# Altium schematic sheet M.2 & CSI2.SchDoc
size A4; SheetNumber: 4; SheetTotal: 4
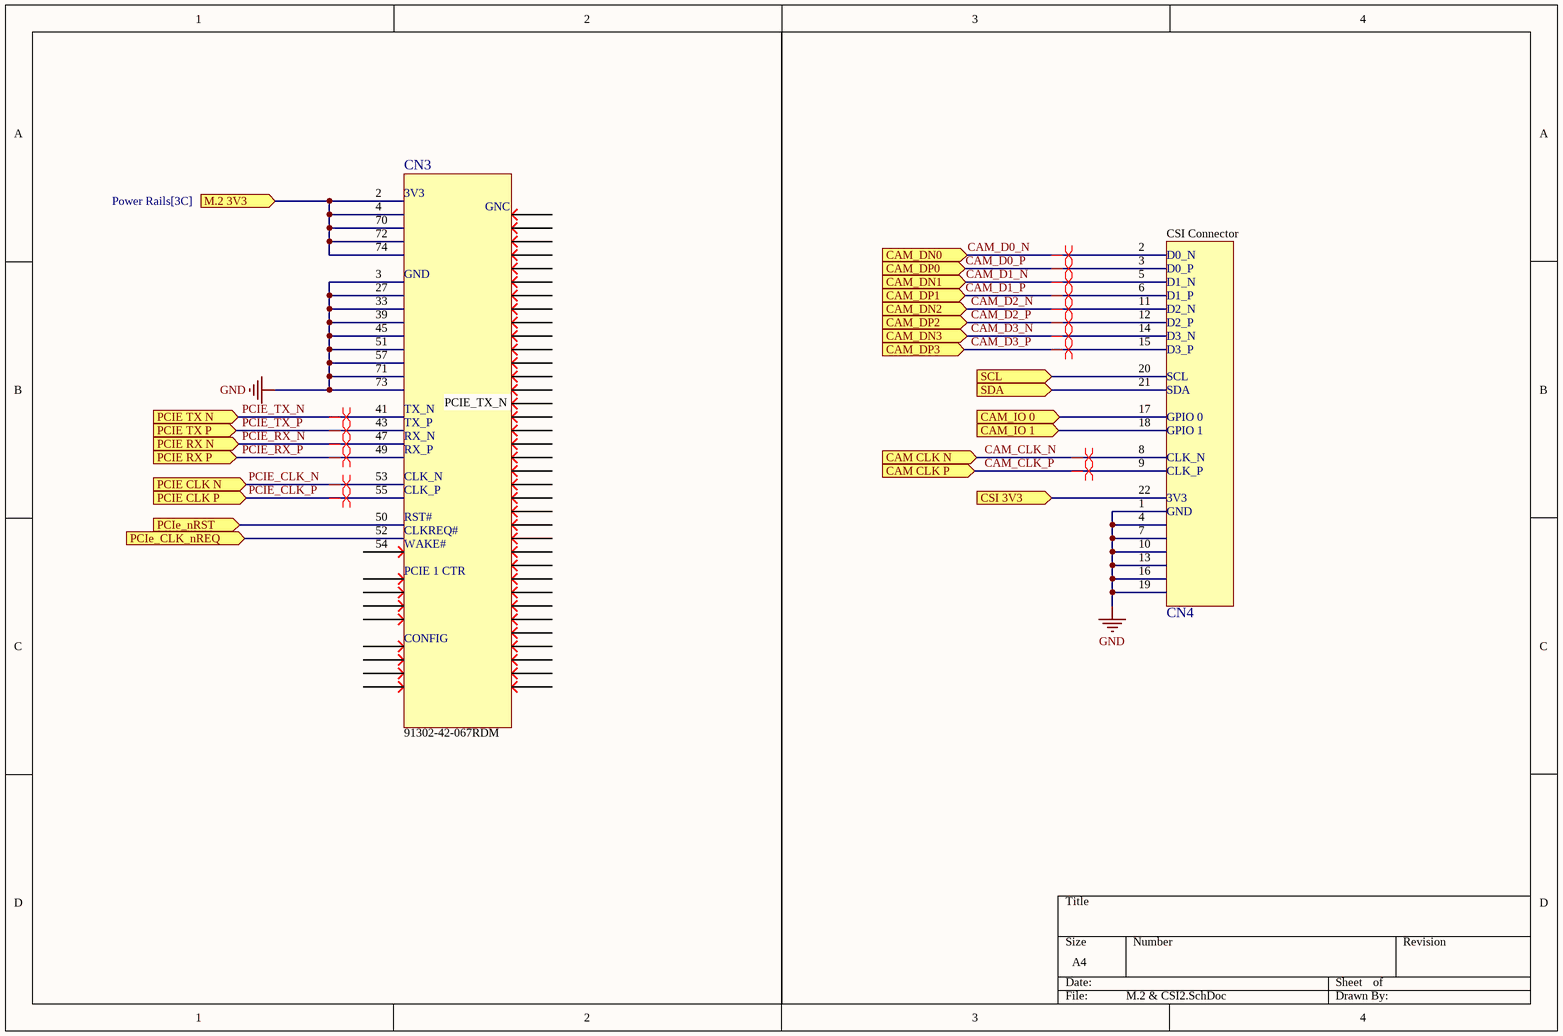
[diagram p0: M.2 & CSI2.SchDoc]

## Parts
CN3  91302-42-067RDM  [CONN-SMD_91302-32-067RDM]
CN4  CSI Connector  [FPC-SMD_22P-P0.50_FH55-22S-0.5SH]

## Ports
CAM CLK N (in, see Amphenol ICC[4A]), CAM CLK P (in, see Amphenol ICC[4A]), CAM_DN0 (in, see Amphenol ICC[4A]), CAM_DN1 (in, see Amphenol ICC[4A]), CAM_DN2 (in, see Amphenol ICC[4A]), CAM_DN3 (in, see Amphenol ICC[4A]), CAM_DP0 (in, see Amphenol ICC[4A]), CAM_DP1 (in, see Amphenol ICC[4A]), CAM_DP2 (in, see Amphenol ICC[4A]), CAM_DP3 (in, see Amphenol ICC[4A]), CAM_IO 0 (in, see Amphenol ICC[1B]), CAM_IO 1 (in, see Amphenol ICC[1B]), CSI 3V3 (in, see Power Rails[4C]), M.2 3V3 (in, see Power Rails[3C]), PCIE CLK N (in, see Amphenol ICC[3A]), PCIE CLK P (in, see Amphenol ICC[3A]), PCIE RX N (in, see Amphenol ICC[3B]), PCIE RX P (in, see Amphenol ICC[3A]), PCIE TX N (in, see Amphenol ICC[3B]), PCIE TX P (in, see Amphenol ICC[3B]), PCIe_CLK_nREQ (in, see Amphenol ICC[3A]), PCIe_nRST (in, see Amphenol ICC[3A]), SCL (in, see Amphenol ICC[1A]), SDA (in, see Amphenol ICC[1A])

## Nets
GND: CN3.3 CN3.27 CN3.33 CN3.39 CN3.45 CN3.51 CN3.57 CN3.71 CN3.73 CN4.1(GND) CN4.4(GND) CN4.7(GND) CN4.10(GND) CN4.13(GND) CN4.16(GND) CN4.19(GND)
CAM_CLK_N: CN4.8(CLK_N) ; port CAM CLK N
CAM_CLK_P: CN4.9(CLK_P) ; port CAM CLK P
CAM_D0_N: CN4.2(DATA_0_N) ; port CAM_DN0
CAM_D0_P: CN4.3(DATA_0_P) ; port CAM_DP0
CAM_D1_N: CN4.5(DATA_1_N) ; port CAM_DN1
CAM_D1_P: CN4.6(DATA_1_P) ; port CAM_DP1
CAM_D2_N: CN4.11(DATA_2_N) ; port CAM_DN2
CAM_D2_P: CN4.12(DATA_2_P) ; port CAM_DP2
CAM_D3_N: CN4.14(DATA_3_N) ; port CAM_DN3
CAM_D3_P: CN4.15(DATA_3_P) ; port CAM_DP3
CAM_IO 0: CN4.17(GPIO_0) ; port CAM_IO 0
CAM_IO 1: CN4.18(GPIO_1) ; port CAM_IO 1
CSI 3V3: CN4.22(PWR) ; port CSI 3V3
M.2 3V3: CN3.2 CN3.4 CN3.70 CN3.72 CN3.74 ; port M.2 3V3
PCIE_CLK_N: CN3.53 ; port PCIE CLK N
PCIe_CLK_nREQ: CN3.52 ; port PCIe_CLK_nREQ
PCIE_CLK_P: CN3.55 ; port PCIE CLK P
PCIe_nRST: CN3.50 ; port PCIe_nRST
PCIE_RX_N: CN3.47 ; port PCIE RX N
PCIE_RX_P: CN3.49 ; port PCIE RX P
PCIE_TX_N: CN3.41 ; port PCIE TX N
PCIE_TX_P: CN3.43 ; port PCIE TX P
SCL: CN4.20(SCL) ; port SCL
SDA: CN4.21(SDA) ; port SDA

Not connected (* = marked no-connect by the designer): CN3 1* 5* 6* 7* 8* 9* 10* 11* 12* 13* 14* 15* 16* 17* 18* 19* 20* 21* 22* 23* 24* 25* 26* 28* 29* 30* 31* 32* 34* 35* 36* 37* 38* 40* 42* 44* 46* 48* 54* 56* 58* 67* 68* 69* 75*

## Layout directives
differential pair: CAM_CLK_N, CAM_CLK_P, CAM_D0_N, CAM_D0_P, CAM_D1_N, CAM_D1_P, CAM_D2_N, CAM_D2_P, CAM_D3_N, CAM_D3_P, PCIE_CLK_N, PCIE_CLK_P, PCIE_RX_N, PCIE_RX_P, PCIE_TX_N, PCIE_TX_P

## Notes on the sheet
- (near CN3) PCIE_TX_N
- (in symbol 91302-42-067RDM) 3V3; GNC; GND; TX_N; TX_P; RX_N; RX_P; CLK_N; CLK_P; RST#; CLKREQ#; WAKE#; PCIE 1 CTR; CONFIG
- (in symbol FH55-22S-0.5SH) D0_N; D0_P; D1_N; D1_P; D2_N; D2_P; D3_N; D3_P; 3V3

## Library data of the parts
CN3 = 91302-42-067RDM: 67P Surface Mount, Right Angle SMD,P=0.5mm Centronics Connectors RoHS; Name: C601195; Source: LCSC
CN4 = FH55-22S-0.5SH: Flip-Top -55â„ƒ~+85â„ƒ 22P 0.5mm 500mA 50V Gold Surface Mount, Right Angle Phosphor bronze SMD,P=0.5mm FFC, FPC (Flat Flexible) Connector Assemblies RoHS; Name: C5182313; Source: LCSC